# EAGLE design SkateMate_Glove_Extern (EAGLE 8.1.0)
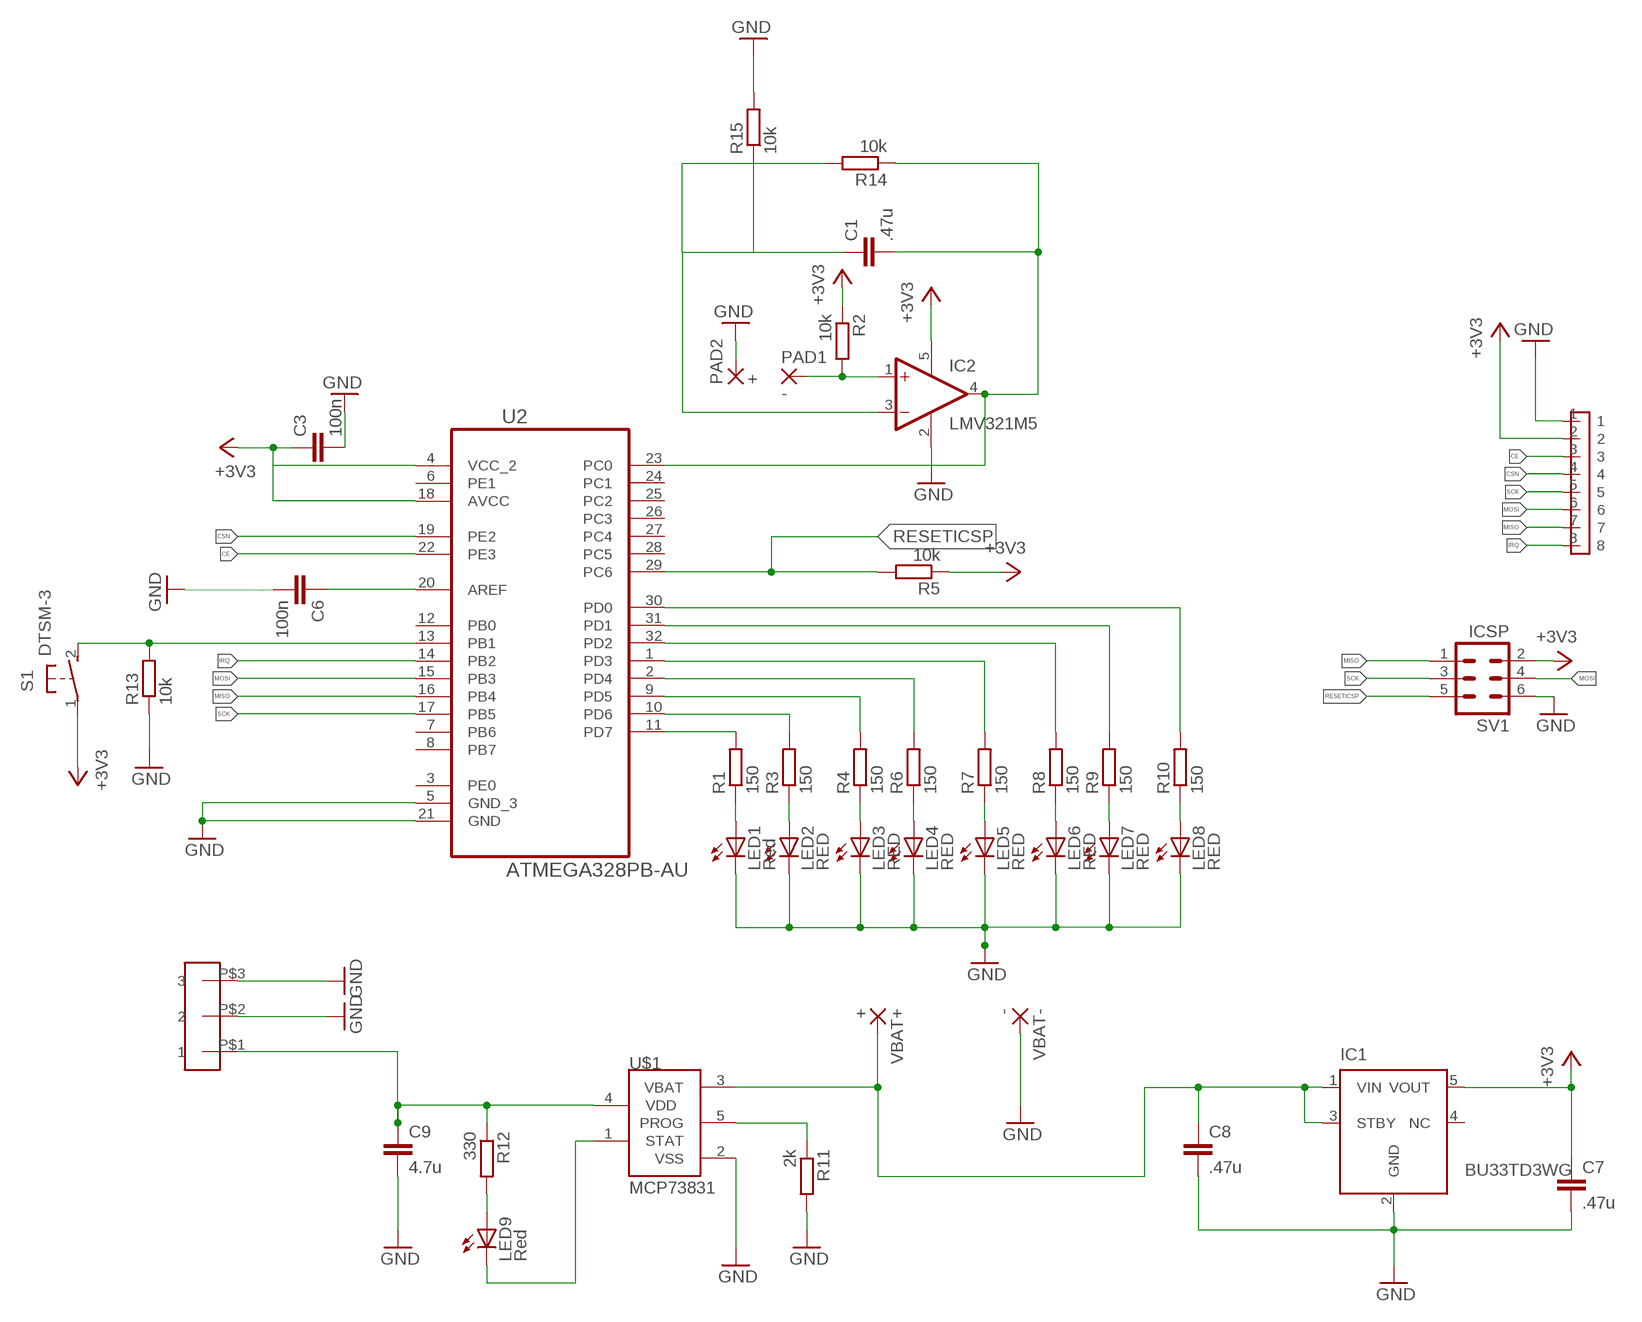
[diagram p0: schematic, sheet 1]

## Parts
C1  .47u  CC0603  [C0603]
C3  100n  CC0603  [C0603]
C6  100n  CC0603  [C0603]
C7  .47u  CC0603  [C0603]
C8  .47u  CC0603  [C0603]
C9  4.7u  CC0603  [C0603]
IC1  BU33TD3WG  BU33TD3WG-TR  [SOT23-5]
IC2  LMV321M5  [SOT23-5]
LED1  Red  LEDCHIPLED_0805  [CHIPLED_0805]
LED2  RED  LEDCHIPLED_0805  [CHIPLED_0805]
LED3  RED  LEDCHIPLED_0805  [CHIPLED_0805]
LED4  RED  LEDCHIPLED_0805  [CHIPLED_0805]
LED5  RED  LEDCHIPLED_0805  [CHIPLED_0805]
LED6  RED  LEDCHIPLED_0805  [CHIPLED_0805]
LED7  RED  LEDCHIPLED_0805  [CHIPLED_0805]
LED8  RED  LEDCHIPLED_0805  [CHIPLED_0805]
LED9  Red  LEDCHIPLED_0805  [CHIPLED_0805]
PAD1  -  1,6/0,8  [1,6/0,8]
PAD2  +  1,6/0,8  [1,6/0,8]
R1  150  RR0603  [R0603]
R2  10k  RR0603  [R0603]
R3  150  RR0603  [R0603]
R4  150  RR0603  [R0603]
R5  10k  RR0603  [R0603]
R6  150  RR0603  [R0603]
R7  150  RR0603  [R0603]
R8  150  RR0603  [R0603]
R9  150  RR0603  [R0603]
R10  150  RR0603  [R0603]
R11  2k  RR0603  [R0603]
R12  330  RR0603  [R0603]
R13  10k  RR0603  [R0603]
R14  10k  RR0603  [R0603]
R15  10k  RR0603  [R0603]
S1  DTSM-3  [DTSM-3]
SV1  ICSP  MA03-2  [MA03-2]
U2  ATMEGA328PB-AU  [QFP80P900X900X120-32N]
U$1  MCP73831  [SOT23-5L]
U$2  HEADER1,27  [HEADER1,27]
U$3  3PINHEADER  [3PINHEADER]
VBAT+  +  1,6/0,8  [1,6/0,8]
VBAT-  -  1,6/0,8  [1,6/0,8]

## Nets
+3V3: C3.1 C7.1 IC1.5(VOUT) IC2.5(V+) R2.1 R5.1 S1.1 SV1.2 U2.4(VCC_2) U2.18(AVCC) U$2.2
CE: U2.22(PE3) U$2.3
CSN: U2.19(PE2) U$2.4
GND: C3.2 C6.2 C7.2 C8.2 C9.2 IC1.2(GND) IC2.2(V-) LED1.C LED2.C LED3.C LED4.C LED5.C LED6.C LED7.C LED8.C PAD2.1(P) R11.2 R13.1 R15.2 SV1.6 U2.5(GND_3) U2.21(GND) U$1.2(VSS) U$2.1 U$3.P$2 U$3.P$3 VBAT-.1(P)
IRQ: U2.14(PB2) U$2.8
MISO: SV1.1 U2.16(PB4) U$2.7
MOSI: SV1.4 U2.15(PB3) U$2.6
N$1: LED1.A R1.1
N$2: LED2.A R3.1
N$3: R13.2 S1.2 U2.13(PB1)
N$4: C6.1 U2.20(AREF)
N$5: C1.1 IC2.3(-IN) R14.2 R15.1
N$6: LED3.A R4.1
N$7: LED6.A R8.1
N$8: LED7.A R9.1
N$9: LED8.A R10.1
N$10: LED4.A R6.1
N$11: LED5.A R7.1
N$12: R1.2 U2.11(PD7)
N$13: R3.2 U2.10(PD6)
N$14: C1.2 IC2.4(OUT) R14.1 U2.23(PC0)
N$15: R4.2 U2.9(PD5)
N$16: R6.2 U2.2(PD4)
N$17: R7.2 U2.1(PD3)
N$18: R8.2 U2.32(PD2)
N$19: R9.2 U2.31(PD1)
N$20: R10.2 U2.30(PD0)
N$21: C8.1 IC1.1(VIN) IC1.3(STBY) U$1.3(VBAT) VBAT+.1(P)
N$22: LED9.A R12.2
N$23: LED9.C U$1.1(STAT)
N$24: C9.1 R12.1 U$1.4(VDD) U$3.P$1
N$25: R11.1 U$1.5(PROG)
N$26: IC2.1(+IN) PAD1.1(P) R2.2
RESETICSP: R5.2 SV1.5 U2.29(PC6)
SCK: SV1.3 U2.17(PB5) U$2.5
Unconnected: IC1.4(NC) U2.3(PE0) U2.6(PE1) U2.7(PB6) U2.8(PB7) U2.12(PB0) U2.24(PC1) U2.25(PC2) U2.26(PC3) U2.27(PC4) U2.28(PC5)

## Library data of the parts
C1 C3 C6-C9 = eagle-ltspice:C: CAPACITOR, European symbol; SPICEMODEL: NONE; SPICEPREFIX: C
IC1 = BU33TD3WG:BU33TD3WG-TR: VOLTAGE REGULATOR; OC_FARNELL: unknown; OC_NEWARK: unknown
IC2 = linear:LMV321?*: General Purpose, Low Voltage, Rail-to-Rail Output Operational Amplifiers Source: http://www.national.com/mpf/LM/LMV321.html http://www.national.com/dt/lmv_qual.pdf
LED1-LED9 = led:LED: LED OSRAM: - CHIPLED LG R971, LG N971, LY N971, LG Q971, LY Q971, LO R971, LY R971 LH N974, LH R974 LS Q976, LO Q976, LY Q976 LO Q996 - Hyper CHIPLED LW Q18S LB Q993, LB Q99A, LB R99A - SideLED LS A670, LO A670, LY A670, LG A670, LP A670 LB A673, LV A673, LT A673, LW A673 LH A674 LY A675 LS A676, LA A676, LO A676, LY A676, LW A676 LS A679, LY A679, LG A679 - Hyper Micro SIDELED® LS Y876, LA Y876, LO Y876, LY Y876 LT Y87S - SmartLED LW L88C, LW L88S LB L89C, LB L89S, LG L890 LS L89K, LO L89K, LY L89K LS L896, LA L896, LO L896, LY L896 - TOPLED LS T670, LO T670, LY T670, LG T670, LP T670 LSG T670, LSP T670, LSY T670, LOP T670, LYG T670 LG T671, LOG T671, LSG T671 LB T673, LV T673, LT T673, LW T673 LH T674 LS T676, LA T676, LO T676, LY T676, LB T676, LH T676, LSB T676, LW T676 LB T67C, LV T67C, LT T67C, LS T67K, LO T67K, LY T67K, LW E67C LS E67B, LA E67B, LO E67B, LY E67B, LB E67C, LV E67C, LT E67C LW T67C LS T679, LY T679, LG T679 LS T770, LO T770, LY T770, LG T770, LP T770 LB T773, LV T773, LT T773, LW T773 LH T774 LS E675, LA E675, LY E675, LS T675 LS T776, LA T776, LO T776, LY T776, LB T776 LHGB T686 LT T68C, LB T68C - Hyper Mini TOPLED® LB M676 - Mini TOPLED Santana® LG M470 LS M47K, LO M47K, LY M47K Source: http://www.osram.convergy.de LUXEON: - LUMILED® LXK2-PW12-R00, LXK2-PW12-S00, LXK2-PW14-U00, LXK2-PW14-V00 LXK2-PM12-R00, LXK2-PM12-S00, LXK2-PM14-U00 LXK2-PE12-Q00, LXK2-PE12-R00, LXK2-PE12-S00, LXK2-PE14-T00, LXK2-PE14-U00 LXK2-PB12-K00, LXK2-PB12-L00, LXK2-PB12-M00, LXK2-PB14-N00, LXK2-PB14-P00, LXK2-PB14-Q00 LXK2-PR12-L00, LXK2-PR12-M00, LXK2-PR14-Q00, LXK2-PR14-R00 LXK2-PD12-Q00, LXK2-PD12-R00, LXK2-PD12-S00 LXK2-PH12-R00, LXK2-PH12-S00 LXK2-PL12-P00, LXK2-PL12-Q00, LXK2-PL12-R00 Source: www.luxeon.com KINGBRIGHT: KA-3528ASYC Source: www.kingbright.com
PAD1 PAD2 VBAT+ VBAT- = wirepad:1,6/0,8: THROUGH-HOLE PAD
R1-R15 = eagle-ltspice:R: RESISTOR, European symbol; SPICEMODEL: NONE; SPICEPREFIX: R
S1 = switch-tact:DTSM-3
SV1 = con-lstb:MA03-2: PIN HEADER; OC_FARNELL: unknown; OC_NEWARK: unknown
U2 = Atmel_By_element14_Batch_1-00:ATMEGA328PB-AU: 8-bit Microcontroller with In-System Programmable Flash; MPN: ATMEGA328P-AU; OC_FARNELL: 1715486; OC_NEWARK: 14R4631; PACKAGE: TQFP-32; SUPPLIER: Atmel
U$1 = MCP73831:MCP73831: Miniature Single-Cell, Fully Integrated Li-Ion, Li-Polymer Charge Management Controllers
U$2 = SkateMateMagicGlove:HEADER1,27
U$3 = SkateMateMagicGlove:3PINHEADER

## Board
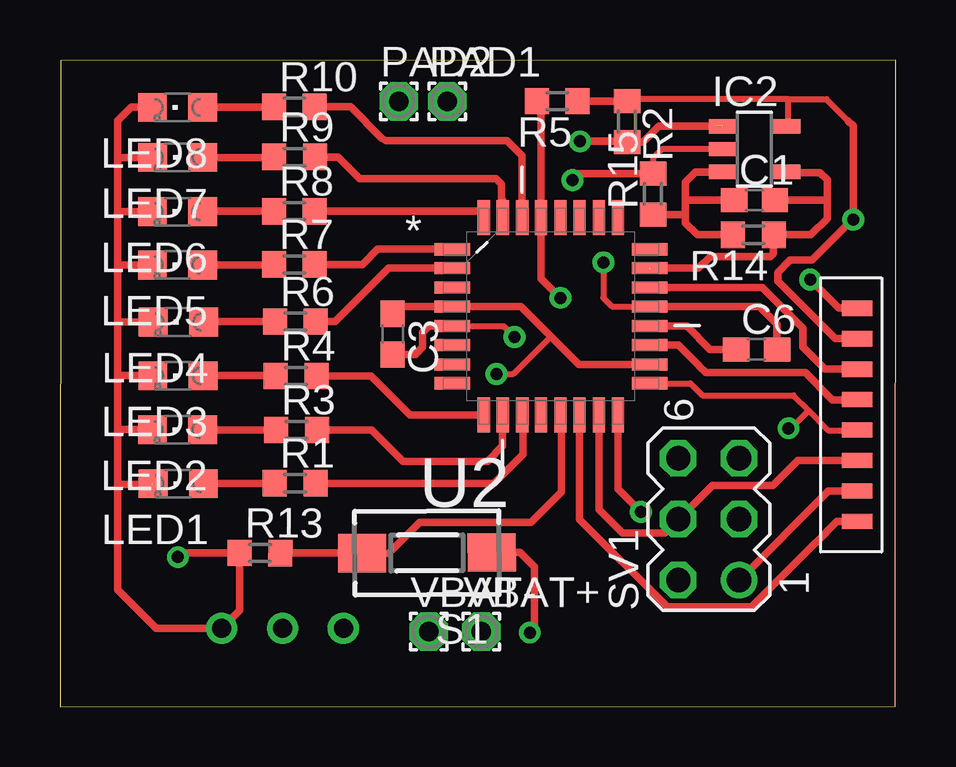
[diagram p1: board, top side]
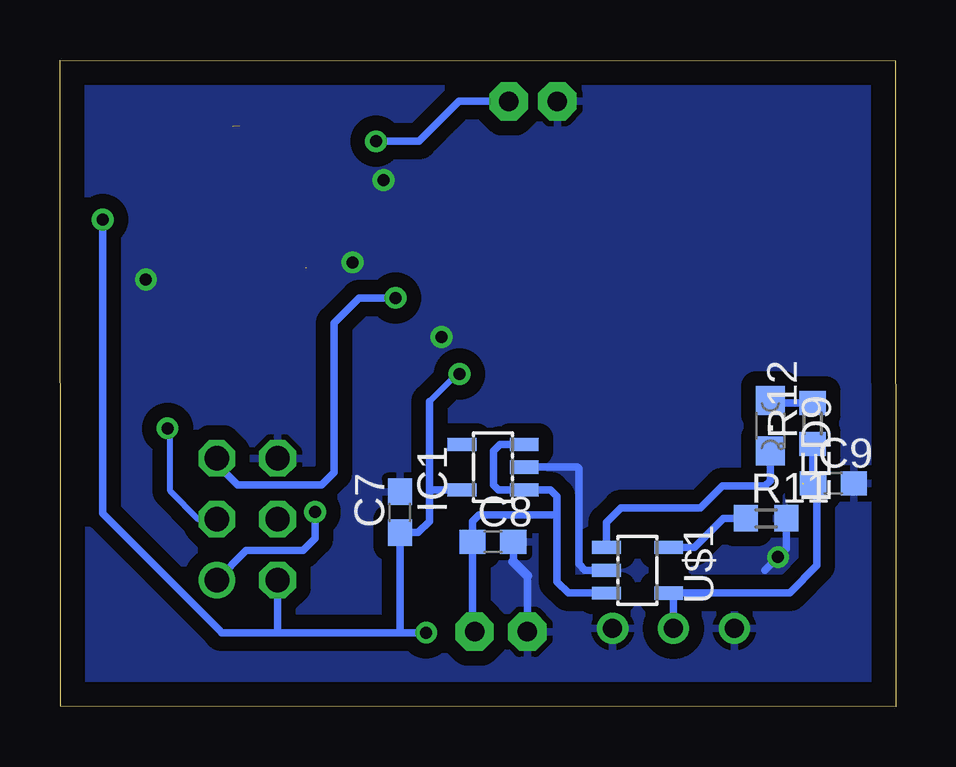
[diagram p2: board, bottom side, seen from below]

Size 34.85 x 26.98 mm. Coordinates in mm from the lower left corner, seen from the top.
Outline: 0,0 34.82,0.04 34.85,26.98 0.04,26.94 0,0
Copper layers (1*16): Top 0.035mm / dielectric 1.5mm / Bottom 0.035mm
Design rules "default *": minimum track width 10mil, minimum drill 24mil, track to track 8mil, track to pad 8mil, pad to pad 8mil, via to via 8mil, smd to smd 8mil, copper to edge 40mil, drill to drill 8mil, minimum pad ring 10mil, minimum via ring 8mil, stop-mask expansion 4mil, vias tented up to drill 0mil, thermal gap 10mil

### Footprints (pad centres in the part's own frame; a part is rotated, then mirrored left to right if it is on the bottom)
C0603 = smd 1.1 x 1: 1 -0.85,0; 2 0.85,0
SOT23-5 = smd 0.55 x 1.2: 1 -0.95,-1.3; 2 0,-1.3; 3 0.95,-1.3; 4 0.95,1.3; 5 -0.95,1.3
SOT23-5' = smd 0.6 x 1.2: 1 -0.95,-1.306; 2 0,-1.306; 3 0.95,-1.306; 4 0.95,1.306; 5 -0.95,1.306
CHIPLED_0805 = smd 1.2 x 1.2: A 0,-1.05; C 0,1.05
1,6/0,8 = drill 0.813 pad 1.6 octagon: 1 0,0
R0603 = smd 1 x 1.1: 1 -0.85,0; 2 0.85,0
DTSM-3 = smd 2 x 1.6: 1 -2.7,0; 2 2.7,0
MA03-2 = drill 1.016: 1 -2.54,-1.27 | drill 1.016 octagon: 2 -2.54,1.27; 3 0,-1.27; 4 0,1.27; 5 2.54,-1.27; 6 2.54,1.27
QFP80P900X900X120-32N = smd 1.473 x 0.508: 1 -4.115,2.794; 2 -4.115,2.007; 3 -4.115,1.194; 4 -4.115,0.406; 5 -4.115,-0.406; 6 -4.115,-1.194; 7 -4.115,-2.007; 8 -4.115,-2.794; 17 4.115,-2.794; 18 4.115,-2.007; 19 4.115,-1.194; 20 4.115,-0.406; 21 4.115,0.406; 22 4.115,1.194; 23 4.115,2.007; 24 4.115,2.794 | smd 0.508 x 1.473: 9 -2.794,-4.115; 10 -2.007,-4.115; 11 -1.194,-4.115; 12 -0.406,-4.115; 13 0.406,-4.115; 14 1.194,-4.115; 15 2.007,-4.115; 16 2.794,-4.115; 25 2.794,4.115; 26 2.007,4.115; 27 1.194,4.115; 28 0.406,4.115; 29 -0.406,4.115; 30 -1.194,4.115; 31 -2.007,4.115; 32 -2.794,4.115
SOT23-5L = smd 0.533 x 1.2: 1 -0.95,-1.3; 2 0,-1.3; 3 0.95,-1.3 | smd 0.55 x 1.2: 4 0.95,1.3; 5 -0.95,1.3
HEADER1,27 = smd 1.27 x 0.635: 1 -1.016,4.445; 2 -1.016,3.175; 3 -1.016,1.905; 4 -1.016,0.635; 5 -1.016,-0.635; 6 -1.016,-1.905; 7 -1.016,-3.175; 8 -1.016,-4.445
3PINHEADER = drill 0.8: P$1 0,0; P$2 0,2.54; P$3 0,-2.54

### Placement (x,y rotation side)
C1  28.95,21.13 0 top
C3  13.87,15.55 270 top
C6  29.04,14.91 0 top
C7  20.69,8.12 90 bottom
C8  16.81,6.88 0 bottom
C9  2.61,9.33 0 bottom
IC1  16.8,10 90 bottom
IC2  LMV321M5  [SOT23-5']  28.95,23.26 270 top
LED1  4.93,9.31 90 top
LED2  4.9,11.56 90 top
LED3  4.92,13.81 90 top
LED4  4.94,16.05 90 top
LED5  4.9,18.43 90 top
LED6  4.9,20.65 90 top
LED7  4.91,22.91 90 top
LED8  4.9,25 90 top
LED9  5.24,11.73 180 bottom
PAD1  16.15,25.25 0 top
PAD2  14.12,25.25 0 top
R1  9.8,9.33 0 top
R2  23.64,24.4 270 top
R3  9.86,11.55 0 top
R4  9.84,13.8 0 top
R5  20.73,25.26 180 top
R6  9.81,16.07 0 top
R7  9.77,18.45 0 top
R8  9.77,20.67 0 top
R9  9.78,22.93 0 top
R10  9.77,25.02 0 top
R11  5.42,7.87 0 bottom
R12  3.48,11.82 90 bottom
R13  8.34,6.42 359.7 top
R14  28.9,19.69 180 top
R15  24.72,21.39 90 top
S1  15.3,6.43 180.3 top
SV1  27.05,7.83 90 top
U2  20.46,16.29 0 top
U$1  10.78,5.7 270 bottom
U$2  34.25,12.18 0 top
U$3  9.28,3.28 90 top
VBAT+  17.57,3.14 0 top
VBAT-  15.37,3.14 0 top

### Tracks (layer width: path | path; a pad name or v marks a point on that pad's centre or on a via)
+3V3  (via drill 0.5 pad 0.61, 0.5 pad 0.81)
  Top 0.254: v18.2,13.89 18.9,13.89 20.47,15.46 | 32.87,24.43 31.96,25.34 30.36,25.34 | 30.36,25.34 23.73,25.34 R2.1 | IC2.5 30.36,24.21 30.36,25.34
  Top 0.305: S1.1 19.18,6.44 19.79,5.83 19.79,3.31 v19.58,3.1 | 16.34,16.69 U2.4 | U2.18 21.63,14.29 20.47,15.46 19.23,16.7 U2.4 | U$2.2 32.32,15.36 29.92,17.75 29.92,18.12 30.43,18.63 31.33,18.63 33.02,20.32 v33.07,20.32 33.07,24.23 32.87,24.43 | U2.4 14.16,16.7 C3.1 | R5.1 R2.1
  Bottom 0.254: v18.2,13.89 18.3,13.89 19.45,12.74 | 28.11,3.1 28.2,3.19
  Bottom 0.305: IC1.5 19.35,9.05 19.45,9.15 19.45,9.3 | v19.58,3.1 20.7,3.1 | 19.45,12.74 19.45,9.3 | 25.81,5.29 SV1.2 25.78,3.26 | v33.07,20.32 33.07,8.06 28.2,3.19 | 25.78,3.26 25.78,3.1 | 19.45,9.3 19.45,7.74 19.92,7.27 C7.1 20.69,3.1 20.7,3.1 | 20.7,3.1 25.6,3.1 | 25.6,3.1 25.78,3.1 | 25.78,3.1 25.78,3.26 | 25.6,3.1 28.11,3.1
CE
  Top 0.305: U2.22 29.29,17.48 30.96,15.81 30.96,15.01 31.88,14.09 U$2.3
CSN
  Top 0.305: U2.19 25.78,15.1 26.64,14.23 26.64,14.22 26.92,13.94 31.06,13.94 32.19,12.81 U$2.4
GND  (via drill 0.5 pad 0.25, 0.5 pad 0.61, 0.5 pad 0.81)  (1 unrouted)
  Top 0.254: U2.21 23.01,16.7 22.65,17.06 v22.65,18.54 | U2.5 18.49,15.88 v18.95,15.43 | IC2.2 25.1,23.26 24.72,22.88 R15.2
  Top 0.305: 3.85,9.28 2.41,9.28 2.41,9.46 | 4.81,6.14 v4.92,6.25 5.09,6.42 R13.1 7.49,4.03 U$3.P$2 4.01,3.28 2.41,4.88 2.41,9.46 | LED8.C 2.97,25 2.41,24.44 2.41,22.91 | 2.41,11.44 2.41,9.46 | 2.41,13.81 2.41,15.94 | 2.41,13.81 2.41,11.44 | 2.41,18.43 2.41,15.94 | 2.41,20.65 2.41,18.43 | 2.41,22.91 2.41,20.65 | LED2.C 2.53,11.56 2.41,11.44 | 2.41,15.94 2.52,16.05 LED4.C | LED3.C 2.41,13.81 | LED5.C 2.41,18.43 | LED6.C 2.41,20.65 | LED7.C 2.41,22.91 | U2.5 15.39,15.88 15.12,15.62 15.12,15 14.82,14.7 C3.2 | 24.59,16.71 U2.21 29.05,16.7 29.15,16.7 29.89,15.96 C6.2 | U$2.1 32.47,16.63 v31.27,17.82 | R15.2 21.64,22.24 v21.36,21.96
  Bottom 0.305: R11.2 4.57,6.6 v4.92,6.25 5.47,5.7 | IC1.2 13.28,10 13.23,9.95 13.23,5.96 12.97,5.7 U$1.2 | C8.2 15.96,6.05 | 15.37,5.47 VBAT-.1
  Bottom 0.406: 15.96,6.05 15.37,5.47
  pour Bottom (isolate 0.61): -0.19,26.69 34.7,26.73 34.56,0.44 -0.33,0.4
IRQ
  Top 0.305: U2.14 21.66,7.83 25.22,4.27 25.32,4.17 28.82,4.17 31.49,6.85 31.5,6.85 32.39,7.74 U$2.8
MISO  (via drill 0.5 pad 0.25)
  Top 0.305: U2.16 23.26,9.09 v24.21,8.13 | U$2.7 32.04,9.01 SV1.1
  Bottom 0.305: v24.22,8.13 v24.21,8.13 24.21,7.03 24.72,6.52 27.09,6.52 SV1.1
MOSI
  Top 0.305: U2.15 22.47,8.24 23.45,7.26 25.21,7.26 SV1.4 27.19,9.24 29.72,9.24 30.76,10.28 U$2.6
N$1
  Top 0.305: LED1.A 8.93,9.31 R1.1
N$2
  Top 0.305: R3.1 LED2.A
N$3
  Top 0.305: R13.2 S1.2 13.71,6.41 15,7.7 19.64,7.7 20.91,8.97 20.91,12.18 20.9,12.18 U2.13
N$4
  Top 0.305: 24.59,15.89 U2.20 26.13,15.88 27.1,14.91 C6.1
N$5
  Top 0.305: R14.2 26.57,19.69 26.07,20.18 26.07,20.5 | 26.07,20.5 26.07,21.23 | 26.07,21.23 26.07,21.89 26.49,22.31 IC2.3 | C1.1 26.18,21.13 26.07,21.23 | R15.1 26.03,20.54 26.07,20.5
N$6
  Top 0.305: LED3.A 8.98,13.81 R4.1
N$7
  Top 0.305: R8.1 5.97,20.67 LED6.A
N$8
  Top 0.305: LED7.A 8.91,22.91 R9.1
N$9
  Top 0.305: 5.97,25.02 LED8.A 8.9,25 R10.1
N$10
  Top 0.305: R6.1 6.01,16.07 LED4.A
N$11
  Top 0.305: LED5.A 8.9,18.43 R7.1
N$12
  Top 0.305: U2.11 19.29,12.15 19.29,10.54 18.08,9.33 R1.2
N$13
  Top 0.305: U2.10 18.46,10.88 17.81,10.24 14.3,10.24 12.99,11.55 R3.2
N$14  (1 unrouted)
  Top 0.305: 30.27,22.3 IC2.4 30.28,22.29 31.68,22.29 31.98,21.99 31.98,21.13 | 31.98,21.13 31.98,20.37 31.3,19.69 R14.1 29.6,19.69 29.46,19.54 29.74,19.26 29.74,18.91 29.62,18.78 27.11,18.78 26.62,18.3 24.62,18.3 | C1.2 31.98,21.13
N$15
  Top 0.305: U2.9 14.6,12.18 12.97,13.8 R4.2
N$16
  Top 0.305: U2.2 13.7,18.3 11.47,16.07 R6.2
N$17
  Top 0.305: R7.2 12.6,18.45 13.24,19.08 U2.1
N$18
  Top 0.305: R8.2 17.64,20.67 17.67,20.64 U2.32
N$19
  Top 0.305: R9.2 11.59,22.93 12.48,22.04 18.17,22.04 18.41,21.8 18.41,21.19 18.46,21.15 U2.31
N$20
  Top 0.305: R10.2 12.11,25.02 13.4,23.73 13.58,23.62 18.63,23.62 19.27,22.98 U2.30 19.27,21.46
N$21
  Bottom 0.305: 14.24,8.01 14.25,8 | IC1.1 | U$1.3 13.66,4.75 14.13,5.22 14.13,5.87 | 14.13,5.87 14.13,5.88 | 14.13,5.87 14.13,8.12 | IC1.1 14.41,9.06 14.13,8.77 14.13,8.12 | IC1.1 16.57,9.05 16.78,9.26 16.78,10.68 16.52,10.94 IC1.3 | 14.24,8.01 17.39,8.01 17.65,7.75 C8.1 17.66,3.23 VBAT+.1 | 14.13,8.12 14.24,8.01
N$22
  Bottom 0.305: R12.2 5.13,12.67 LED9.A
N$23
  Bottom 0.305: U$1.1 12.07,7.7 11.46,8.3 8.16,8.3 7.24,9.21 5.46,9.21 5.25,9.43 5.25,10.67 LED9.C
N$24
  Bottom 0.305: U$3.P$1 9.28,4.55 U$1.4 9.46,4.77 4.42,4.77 3.29,5.89 3.29,9.16 C9.1 3.46,10.96 R12.1
N$25
  Bottom 0.305: U$1.5 8.41,6.65 7.19,7.87 R11.1
N$26  (via drill 0.5 pad 0.81)  (1 unrouted)
  Top 0.254: 23.42,23.78 R2.2
  Top 0.305: 27.36,24.25 | v21.68,23.59 23.61,23.59 R2.2 24.31,23.55 24.96,24.21 IC2.1
  Bottom 0.305: PAD1.1 16.24,25.26 18.21,25.26 19.89,23.59 v21.68,23.59
RESETICSP  (via drill 0.5 pad 0.81)
  Top 0.305: 20.09,20.44 U2.29 | U2.29 20.06,17.86 v20.86,17.06 | R5.2 20.06,25.08 U2.29
  Bottom 0.305: v20.86,17.06 22.38,17.06 23.43,16.01 23.43,9.78 23.95,9.25 26.24,9.25 26.25,9.26 27.45,9.26 28.32,10.13 SV1.5
SCK  (via drill 0.5 pad 0.25)
  Top 0.254: U2.17 26.28,13.5 26.78,12.99 30.57,12.99 31.21,12.36 | 31.21,12.36 32.02,11.54 U$2.5 | v30.37,11.62 30.47,11.62 31.21,12.36
  Top 0.305: 24.64,13.43 U2.17
  Bottom 0.254: SV1.3 29.08,7.83 30.25,9 30.25,11.5 v30.37,11.62